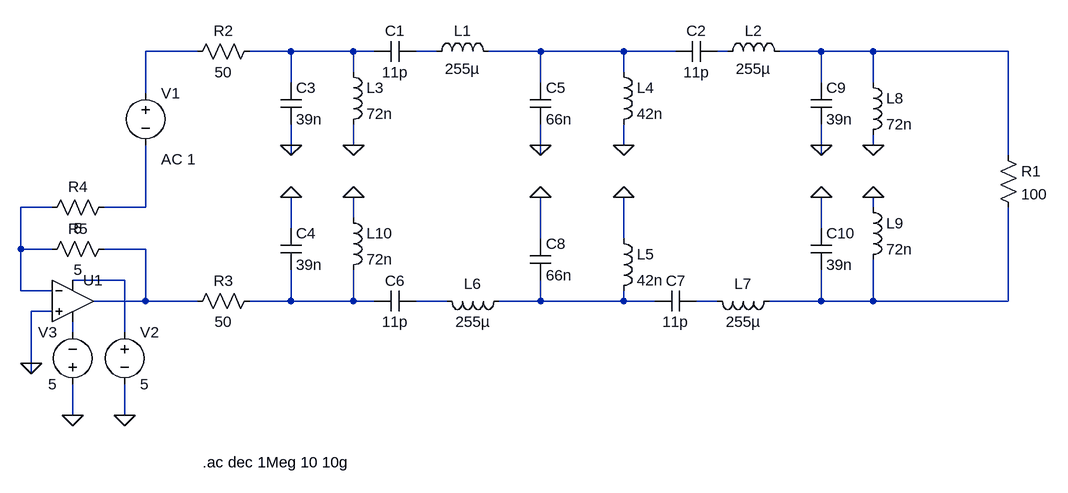
[diagram p0: schematic DE2.asc]
DE2.asc, the LTspice schematic file:
Version 4
SHEET 1 1188 760
WIRE -128 112 -208 112
WIRE 16 112 -48 112
WIRE 112 112 16 112
WIRE 144 112 112 112
WIRE 240 112 208 112
WIRE 400 112 320 112
WIRE 528 112 400 112
WIRE 608 112 528 112
WIRE 688 112 672 112
WIRE 832 112 768 112
WIRE 912 112 832 112
WIRE 1120 112 912 112
WIRE 112 144 112 112
WIRE 528 144 528 112
WIRE 16 160 16 112
WIRE 400 160 400 112
WIRE 832 160 832 112
WIRE 912 160 912 112
WIRE -208 176 -208 112
WIRE 16 256 16 224
WIRE 112 256 112 224
WIRE 400 256 400 224
WIRE 528 256 528 224
WIRE 832 256 832 224
WIRE 912 256 912 240
WIRE 16 272 16 256
WIRE 400 272 400 256
WIRE 832 272 832 256
WIRE 1120 272 1120 112
WIRE -352 352 -400 352
WIRE -208 352 -208 256
WIRE -208 352 -272 352
WIRE 912 352 912 336
WIRE 112 368 112 336
WIRE 16 384 16 336
WIRE 832 384 832 336
WIRE 400 400 400 336
WIRE 528 400 528 336
WIRE -400 416 -400 352
WIRE -352 416 -400 416
WIRE -208 416 -272 416
WIRE -240 464 -320 464
WIRE -400 480 -400 416
WIRE -352 480 -400 480
WIRE -208 496 -208 416
WIRE -208 496 -288 496
WIRE -128 496 -208 496
WIRE 16 496 16 448
WIRE 16 496 -48 496
WIRE 112 496 112 448
WIRE 112 496 16 496
WIRE 144 496 112 496
WIRE 256 496 208 496
WIRE 400 496 400 464
WIRE 400 496 336 496
WIRE 528 496 528 480
WIRE 528 496 400 496
WIRE 576 496 528 496
WIRE 672 496 640 496
WIRE 832 496 832 448
WIRE 832 496 752 496
WIRE 912 496 912 432
WIRE 912 496 832 496
WIRE 1120 496 1120 352
WIRE 1120 496 912 496
WIRE -352 512 -384 512
WIRE -320 544 -320 528
WIRE -240 544 -240 464
WIRE -384 592 -384 512
WIRE -384 608 -384 592
WIRE -320 672 -320 624
WIRE -240 672 -240 624
FLAG -384 592 0
FLAG -320 672 0
FLAG -240 672 0
FLAG 832 256 0
FLAG 16 256 0
FLAG 16 336 0
FLAG 112 336 0
FLAG 112 256 0
FLAG 400 256 0
FLAG 400 336 0
FLAG 528 256 0
FLAG 912 256 0
FLAG 832 336 0
FLAG 912 336 0
FLAG 528 336 0
SYMBOL cap 208 96 R90
WINDOW 0 0 32 VBottom 2
WINDOW 3 32 32 VTop 2
SYMATTR InstName C1
SYMATTR Value 11p
SYMBOL cap 672 96 R90
WINDOW 0 0 32 VBottom 2
WINDOW 3 32 32 VTop 2
SYMATTR InstName C2
SYMATTR Value 11p
SYMBOL ind 224 128 R270
WINDOW 0 32 56 VTop 2
WINDOW 3 5 56 VBottom 2
SYMATTR InstName L1
SYMATTR Value 255µ
SYMATTR SpiceLine Rser=100
SYMBOL ind 672 128 R270
WINDOW 0 32 56 VTop 2
WINDOW 3 5 56 VBottom 2
SYMATTR InstName L2
SYMATTR Value 255µ
SYMATTR SpiceLine Rser=100
SYMBOL res 1104 256 R0
SYMATTR InstName R1
SYMATTR Value 100
SYMBOL res -32 96 R90
WINDOW 0 0 56 VBottom 2
WINDOW 3 32 56 VTop 2
SYMATTR InstName R2
SYMATTR Value 50
SYMBOL cap 208 480 R90
WINDOW 0 0 32 VBottom 2
WINDOW 3 32 32 VTop 2
SYMATTR InstName C6
SYMATTR Value 11p
SYMBOL cap 640 480 R90
WINDOW 0 0 32 VBottom 2
WINDOW 3 32 32 VTop 2
SYMATTR InstName C7
SYMATTR Value 11p
SYMBOL ind 352 480 R90
WINDOW 0 5 56 VBottom 2
WINDOW 3 32 56 VTop 2
SYMATTR InstName L6
SYMATTR Value 255µ
SYMATTR SpiceLine Rser=100
SYMBOL ind 768 480 R90
WINDOW 0 5 56 VBottom 2
WINDOW 3 32 56 VTop 2
SYMATTR InstName L7
SYMATTR Value 255µ
SYMATTR SpiceLine Rser=100
SYMBOL res -32 480 R90
WINDOW 0 0 56 VBottom 2
WINDOW 3 32 56 VTop 2
SYMATTR InstName R3
SYMATTR Value 50
SYMBOL voltage -208 160 R0
WINDOW 3 24 96 Invisible 2
WINDOW 123 24 118 Left 2
SYMATTR Value ""
SYMATTR Value2 AC 1
SYMATTR InstName V1
SYMBOL Opamps/UniversalOpamp2 -320 496 R0
SYMATTR InstName U1
SYMBOL res -256 336 R90
WINDOW 0 0 56 VBottom 2
WINDOW 3 32 56 VTop 2
SYMATTR InstName R4
SYMATTR Value 5
SYMBOL res -256 400 R90
WINDOW 0 0 56 VBottom 2
WINDOW 3 32 56 VTop 2
SYMATTR InstName R5
SYMATTR Value 5
SYMBOL voltage -240 528 R0
SYMATTR InstName V2
SYMATTR Value 5
SYMBOL voltage -320 640 R180
WINDOW 0 24 96 Left 2
WINDOW 3 24 16 Left 2
SYMATTR InstName V3
SYMATTR Value 5
SYMBOL cap 0 160 R0
SYMATTR InstName C3
SYMATTR Value 39n
SYMBOL cap 0 384 R0
SYMATTR InstName C4
SYMATTR Value 39n
SYMBOL cap 384 160 R0
SYMATTR InstName C5
SYMATTR Value 66n
SYMBOL cap 384 400 R0
SYMATTR InstName C8
SYMATTR Value 66n
SYMBOL cap 816 160 R0
SYMATTR InstName C9
SYMATTR Value 39n
SYMBOL cap 816 384 R0
SYMATTR InstName C10
SYMATTR Value 39n
SYMBOL ind 96 128 R0
SYMATTR InstName L3
SYMATTR Value 72n
SYMATTR SpiceLine Rser=30m
SYMBOL ind 512 128 R0
SYMATTR InstName L4
SYMATTR Value 42n
SYMATTR SpiceLine Rser=15m
SYMBOL ind 512 384 R0
SYMATTR InstName L5
SYMATTR Value 42n
SYMATTR SpiceLine Rser=15m
SYMBOL ind 896 144 R0
SYMATTR InstName L8
SYMATTR Value 72n
SYMATTR SpiceLine Rser=30m
SYMBOL ind 896 336 R0
SYMATTR InstName L9
SYMATTR Value 72n
SYMATTR SpiceLine Rser=30m
SYMBOL ind 96 352 R0
SYMATTR InstName L10
SYMATTR Value 72n
SYMATTR SpiceLine Rser=30m
TEXT -120 744 Left 2 !.ac dec 1Meg 10 10g

The netlist it stands for:
* DE2.asc
C1 N003 N002 11p
C2 N005 N004 11p
L1 N003 N004 255µ Rser=100
L2 N005 N006 255µ Rser=100
R1 N006 N015 100
R2 N002 N001 50
C6 N012 N011 11p
C7 N014 N013 11p
L6 N013 N012 255µ Rser=100
L7 N015 N014 255µ Rser=100
R3 N011 N009 50
V1 N001 N008 AC 1
XU1 0 N007 N010 N016 N009 level.2 Avol=1Meg GBW=10Meg Slew=10Meg ilimit=25m rail=0 Vos=0 phimargin=45 en=0 enk=0 in=0 ink=0 Rin=500Meg  ; pins IN+ IN- V+ V- OUT
R4 N008 N007 5
R5 N009 N007 5
V2 N010 0 5
V3 0 N016 5
C3 N002 0 39n
C4 0 N011 39n
C5 N004 0 66n
C8 0 N013 66n
C9 N006 0 39n
C10 0 N015 39n
L3 N002 0 72n Rser=30m
L4 N004 0 42n Rser=15m
L5 0 N013 42n Rser=15m
L8 N006 0 72n Rser=30m
L9 0 N015 72n Rser=30m
L10 0 N011 72n Rser=30m
.ac dec 1Meg 10 10g
.lib UniversalOpamps2.sub
.backanno
.end